# Altium schematic sheet DSPA.SCHDOC
size B
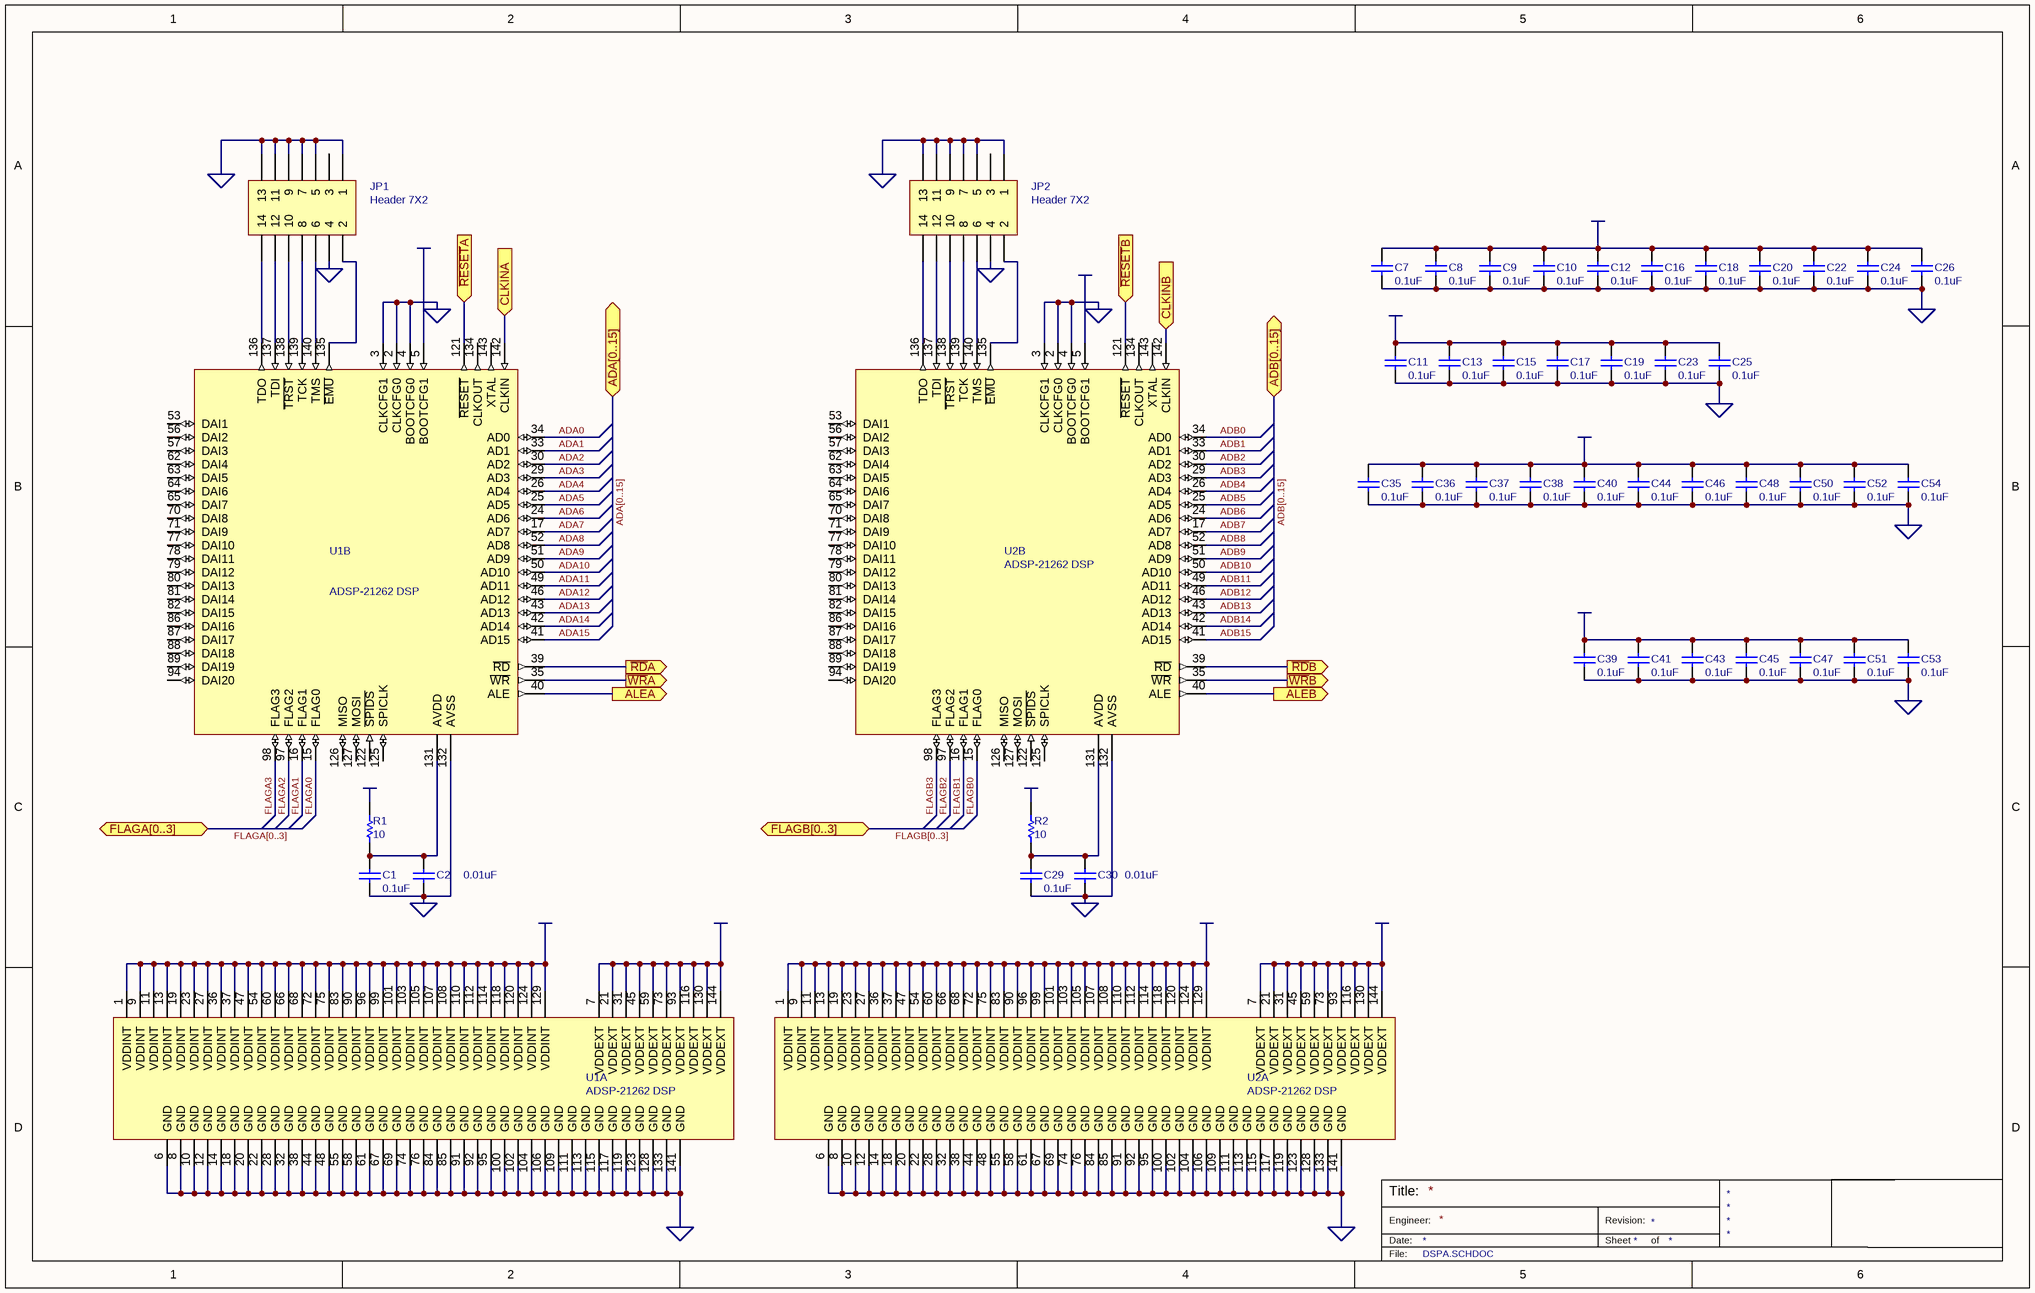
[diagram p0: DSPA.SCHDOC]

## Parts
C1  value 0.1uF  [CC1005-0402]  (hidden comment: Cap)
C2  value 0.01uF  [CC1005-0402]  (hidden comment: Cap)
C7  value 0.1uF  [CC1005-0402]  (hidden comment: Cap)
C8  value 0.1uF  [CC1005-0402]  (hidden comment: Cap)
C9  value 0.1uF  [CC1005-0402]  (hidden comment: Cap)
C10  value 0.1uF  [CC1005-0402]  (hidden comment: Cap)
C11  value 0.1uF  [CC1005-0402]  (hidden comment: Cap)
C12  value 0.1uF  [CC1005-0402]  (hidden comment: Cap)
C13  value 0.1uF  [CC1005-0402]  (hidden comment: Cap)
C15  value 0.1uF  [CC1005-0402]  (hidden comment: Cap)
C16  value 0.1uF  [CC1005-0402]  (hidden comment: Cap)
C17  value 0.1uF  [CC1005-0402]  (hidden comment: Cap)
C18  value 0.1uF  [CC1005-0402]  (hidden comment: Cap)
C19  value 0.1uF  [CC1005-0402]  (hidden comment: Cap)
C20  value 0.1uF  [CC1005-0402]  (hidden comment: Cap)
C22  value 0.1uF  [CC1005-0402]  (hidden comment: Cap)
C23  value 0.1uF  [CC1005-0402]  (hidden comment: Cap)
C24  value 0.1uF  [CC1005-0402]  (hidden comment: Cap)
C25  value 0.1uF  [CC1005-0402]  (hidden comment: Cap)
C26  value 0.1uF  [CC1005-0402]  (hidden comment: Cap)
C29  value 0.1uF  [CC1005-0402]  (hidden comment: Cap)
C30  value 0.01uF  [CC1005-0402]  (hidden comment: Cap)
C35  value 0.1uF  [CC1005-0402]  (hidden comment: Cap)
C36  value 0.1uF  [CC1005-0402]  (hidden comment: Cap)
C37  value 0.1uF  [CC1005-0402]  (hidden comment: Cap)
C38  value 0.1uF  [CC1005-0402]  (hidden comment: Cap)
C39  value 0.1uF  [CC1005-0402]  (hidden comment: Cap)
C40  value 0.1uF  [CC1005-0402]  (hidden comment: Cap)
C41  value 0.1uF  [CC1005-0402]  (hidden comment: Cap)
C43  value 0.1uF  [CC1005-0402]  (hidden comment: Cap)
C44  value 0.1uF  [CC1005-0402]  (hidden comment: Cap)
C45  value 0.1uF  [CC1005-0402]  (hidden comment: Cap)
C46  value 0.1uF  [CC1005-0402]  (hidden comment: Cap)
C47  value 0.1uF  [CC1005-0402]  (hidden comment: Cap)
C48  value 0.1uF  [CC1005-0402]  (hidden comment: Cap)
C50  value 0.1uF  [CC1005-0402]  (hidden comment: Cap)
C51  value 0.1uF  [CC1005-0402]  (hidden comment: Cap)
C52  value 0.1uF  [CC1005-0402]  (hidden comment: Cap)
C53  value 0.1uF  [CC1005-0402]  (hidden comment: Cap)
C54  value 0.1uF  [CC1005-0402]  (hidden comment: Cap)
JP1  Header 7X2  [HDR2X7]
JP2  Header 7X2  [HDR2X7]
R1  value 10  [CR1608-0603]  (hidden comment: Res1)
R2  value 10  [CR1608-0603]  (hidden comment: Res1)
U1  ADSP-21262 DSP  [F-QFP20X20-G144/N]  (parts A,B of 2)
U2  ADSP-21262 DSP  [F-QFP20X20-G144/N]  (parts A,B of 2)

## Ports
ADA[0..15] (bidir), ADB[0..15] (bidir), ALEA (out), ALEB (out), CLKINA (in), CLKINB (in), FLAGA[0..3] (bidir), FLAGB[0..3] (bidir), ~{RD}A (out), ~{RD}B (out), ~{RESET}A (in), ~{RESET}B (in), ~{WR}A (out), ~{WR}B (out)

## Nets
+1.2VCC: C7.2 C8.2 C9.2 C10.2 C12.2 C16.2 C18.2 C20.2 C22.2 C24.2 C26.2 C35.2 C36.2 C37.2 C38.2 C40.2 C44.2 C46.2 C48.2 C50.2 C52.2 C54.2 R1.1 R2.1 U1.1(VDDINT) U1.9(VDDINT) U1.11(VDDINT) U1.13(VDDINT) U1.19(VDDINT) U1.23(VDDINT) U1.27(VDDINT) U1.36(VDDINT) U1.37(VDDINT) U1.47(VDDINT) U1.54(VDDINT) U1.60(VDDINT) U1.66(VDDINT) U1.68(VDDINT) U1.72(VDDINT) U1.75(VDDINT) U1.83(VDDINT) U1.90(VDDINT) U1.96(VDDINT) U1.99(VDDINT) U1.101(VDDINT) U1.103(VDDINT) U1.105(VDDINT) U1.107(VDDINT) U1.108(VDDINT) U1.110(VDDINT) U1.112(VDDINT) U1.114(VDDINT) U1.118(VDDINT) U1.120(VDDINT) U1.124(VDDINT) U1.129(VDDINT) U2.1(VDDINT) U2.9(VDDINT) U2.11(VDDINT) U2.13(VDDINT) U2.19(VDDINT) U2.23(VDDINT) U2.27(VDDINT) U2.36(VDDINT) U2.37(VDDINT) U2.47(VDDINT) U2.54(VDDINT) U2.60(VDDINT) U2.66(VDDINT) U2.68(VDDINT) U2.72(VDDINT) U2.75(VDDINT) U2.83(VDDINT) U2.90(VDDINT) U2.96(VDDINT) U2.99(VDDINT) U2.101(VDDINT) U2.103(VDDINT) U2.105(VDDINT) U2.107(VDDINT) U2.108(VDDINT) U2.110(VDDINT) U2.112(VDDINT) U2.114(VDDINT) U2.118(VDDINT) U2.120(VDDINT) U2.124(VDDINT) U2.129(VDDINT)
GND: C1.1 C2.1 C7.1 C8.1 C9.1 C10.1 C11.1 C12.1 C13.1 C15.1 C16.1 C17.1 C18.1 C19.1 C20.1 C22.1 C23.1 C24.1 C25.1 C26.1 C29.1 C30.1 C35.1 C36.1 C37.1 C38.1 C39.1 C40.1 C41.1 C43.1 C44.1 C45.1 C46.1 C47.1 C48.1 C50.1 C51.1 C52.1 C53.1 C54.1 JP1.1 JP1.4 JP1.5 JP1.7 JP1.9 JP1.11 JP1.13 JP2.1 JP2.4 JP2.5 JP2.7 JP2.9 JP2.11 JP2.13 U1.2(CLKCFG0) U1.3(CLKCFG1) U1.4(BOOTCFG0) U1.6(GND) U1.8(GND) U1.10(GND) U1.12(GND) U1.14(GND) U1.18(GND) U1.20(GND) U1.22(GND) U1.28(GND) U1.32(GND) U1.38(GND) U1.44(GND) U1.48(GND) U1.55(GND) U1.58(GND) U1.61(GND) U1.67(GND) U1.69(GND) U1.74(GND) U1.76(GND) U1.84(GND) U1.85(GND) U1.91(GND) U1.92(GND) U1.95(GND) U1.100(GND) U1.102(GND) U1.104(GND) U1.106(GND) U1.109(GND) U1.111(GND) U1.113(GND) U1.115(GND) U1.117(GND) U1.119(GND) U1.123(GND) U1.128(GND) U1.132(AVSS) U1.133(GND) U1.141(GND) U2.2(CLKCFG0) U2.3(CLKCFG1) U2.4(BOOTCFG0) U2.6(GND) U2.8(GND) U2.10(GND) U2.12(GND) U2.14(GND) U2.18(GND) U2.20(GND) U2.22(GND) U2.28(GND) U2.32(GND) U2.38(GND) U2.44(GND) U2.48(GND) U2.55(GND) U2.58(GND) U2.61(GND) U2.67(GND) U2.69(GND) U2.74(GND) U2.76(GND) U2.84(GND) U2.85(GND) U2.91(GND) U2.92(GND) U2.95(GND) U2.100(GND) U2.102(GND) U2.104(GND) U2.106(GND) U2.109(GND) U2.111(GND) U2.113(GND) U2.115(GND) U2.117(GND) U2.119(GND) U2.123(GND) U2.128(GND) U2.132(AVSS) U2.133(GND) U2.141(GND)
VCC: C11.2 C13.2 C15.2 C17.2 C19.2 C23.2 C25.2 C39.2 C41.2 C43.2 C45.2 C47.2 C51.2 C53.2 U1.5(BOOTCFG1) U1.7(VDDEXT) U1.21(VDDEXT) U1.31(VDDEXT) U1.45(VDDEXT) U1.59(VDDEXT) U1.73(VDDEXT) U1.93(VDDEXT) U1.116(VDDEXT) U1.130(VDDEXT) U1.144(VDDEXT) U2.5(BOOTCFG1) U2.7(VDDEXT) U2.21(VDDEXT) U2.31(VDDEXT) U2.45(VDDEXT) U2.59(VDDEXT) U2.73(VDDEXT) U2.93(VDDEXT) U2.116(VDDEXT) U2.130(VDDEXT) U2.144(VDDEXT)
ADA0: U1.34(AD0)
ADA1: U1.33(AD1)
ADA2: U1.30(AD2)
ADA3: U1.29(AD3)
ADA4: U1.26(AD4)
ADA5: U1.25(AD5)
ADA6: U1.24(AD6)
ADA7: U1.17(AD7)
ADA8: U1.52(AD8)
ADA9: U1.51(AD9)
ADA10: U1.50(AD10)
ADA11: U1.49(AD11)
ADA12: U1.46(AD12)
ADA13: U1.43(AD13)
ADA14: U1.42(AD14)
ADA15: U1.41(AD15)
ADB0: U2.34(AD0)
ADB1: U2.33(AD1)
ADB2: U2.30(AD2)
ADB3: U2.29(AD3)
ADB4: U2.26(AD4)
ADB5: U2.25(AD5)
ADB6: U2.24(AD6)
ADB7: U2.17(AD7)
ADB8: U2.52(AD8)
ADB9: U2.51(AD9)
ADB10: U2.50(AD10)
ADB11: U2.49(AD11)
ADB12: U2.46(AD12)
ADB13: U2.43(AD13)
ADB14: U2.42(AD14)
ADB15: U2.41(AD15)
ALEA: U1.40(ALE) ; port ALEA
ALEB: U2.40(ALE) ; port ALEB
CLKINA: U1.142(CLKIN) ; port CLKINA
CLKINB: U2.142(CLKIN) ; port CLKINB
FLAGA0: U1.15(FLAG0)
FLAGA1: U1.16(FLAG1)
FLAGA2: U1.97(FLAG2)
FLAGA3: U1.98(FLAG3)
FLAGB0: U2.15(FLAG0)
FLAGB1: U2.16(FLAG1)
FLAGB2: U2.97(FLAG2)
FLAGB3: U2.98(FLAG3)
~{RD}A: U1.39(~{RD}) ; port ~{RD}A
~{RD}B: U2.39(~{RD}) ; port ~{RD}B
~{RESET}A: U1.121(~{RESET}) ; port ~{RESET}A
~{RESET}B: U2.121(~{RESET}) ; port ~{RESET}B
~{WR}A: U1.35(~{WR}) ; port ~{WR}A
~{WR}B: U2.35(~{WR}) ; port ~{WR}B
NetC1_2: C1.2 C2.2 R1.2 U1.131(AVDD)
NetC29_2: C29.2 C30.2 R2.2 U2.131(AVDD)
NetJP1_2: JP1.2 U1.135(~{EMU})
NetJP1_6: JP1.6 U1.140(TMS)
NetJP1_8: JP1.8 U1.139(TCK)
NetJP1_10: JP1.10 U1.138(~{TRST})
NetJP1_12: JP1.12 U1.137(TDI)
NetJP1_14: JP1.14 U1.136(TDO)
NetJP2_2: JP2.2 U2.135(~{EMU})
NetJP2_6: JP2.6 U2.140(TMS)
NetJP2_8: JP2.8 U2.139(TCK)
NetJP2_10: JP2.10 U2.138(~{TRST})
NetJP2_12: JP2.12 U2.137(TDI)
NetJP2_14: JP2.14 U2.136(TDO)

Not connected (* = marked no-connect by the designer): JP1 3; JP2 3; U1 53(DAI1) 56(DAI2) 57(DAI3) 62(DAI4) 63(DAI5) 64(DAI6) 65(DAI7) 70(DAI8) 71(DAI9) 77(DAI10) 78(DAI11) 79(DAI12) 80(DAI13) 81(DAI14) 82(DAI15) 86(DAI16) 87(DAI17) 88(DAI18) 89(DAI19) 94(DAI20) 122(~{SPIDS}) 125(SPICLK) 126(MISO) 127(MOSI) 134(CLKOUT) 143(XTAL); U2 53(DAI1) 56(DAI2) 57(DAI3) 62(DAI4) 63(DAI5) 64(DAI6) 65(DAI7) 70(DAI8) 71(DAI9) 77(DAI10) 78(DAI11) 79(DAI12) 80(DAI13) 81(DAI14) 82(DAI15) 86(DAI16) 87(DAI17) 88(DAI18) 89(DAI19) 94(DAI20) 122(~{SPIDS}) 125(SPICLK) 126(MISO) 127(MOSI) 134(CLKOUT) 143(XTAL)

## Buses and harness runs
bus ADA[0..15] = port ADA[0..15]
bus ADB[0..15] = port ADB[0..15]
bus FLAGA[0..3] = port FLAGA[0..3]
bus FLAGB[0..3] = port FLAGB[0..3]

## Notes on the sheet
- Title:
- Engineer:
- Date:
- Revision:
- Sheet
- of
- File:

## Library data of the parts
C1 C2 C7-C13 C15-C20 C22-C26 C29 C30 C35-C41 C43-C48 C50-C54 = Cap: Capacitor; Manufacturer: Generic Components; Class I: Passive; Published: 8-Jun-2000; Revision: July-2002: Re-released for DXP Platform.; Publisher: Altium Limited; Class II: Capacitor
JP1 JP2 = Header 7X2: Header, 7-Pin, Dual row; Manufacturer: Generic Components; Class I: Connector; Revision: July-2002: Re-released for DXP Platform.; Publisher: Altium Limited
R1 R2 = Res1: Resistor; Manufacturer: Generic Components; Class I: Passive; Published: 8-Jun-2000; Revision: July-2002: Re-released for DXP Platform.; Publisher: Altium Limited; Class II: Resistor
U1 U2 = ADSP-21262: SHARC 200 MHz 32-bit floating-point SIMD DSP